# EasyEDA Pro project ProPrj_WashMach_F030F4P6_2026-03-06.epro

# Schematic Schematic1
Assembly Variant: Basic; Board Name: Board1; Create Date: 2026-03-01; Page Name: P1; Project Name: WashMach_F030F4P6; Schematic Name: Schematic1; Update Date: 2026-03-01; BladeWidth: 10; Company: 嘉立创EDA; Page Size: A4; RegionStart: 1; ShowBorder: 1; TitleBlock: 1; TitleBlockPosition: 3; Version: V1.0; XRegionCount: 6; YRegionCount: 4
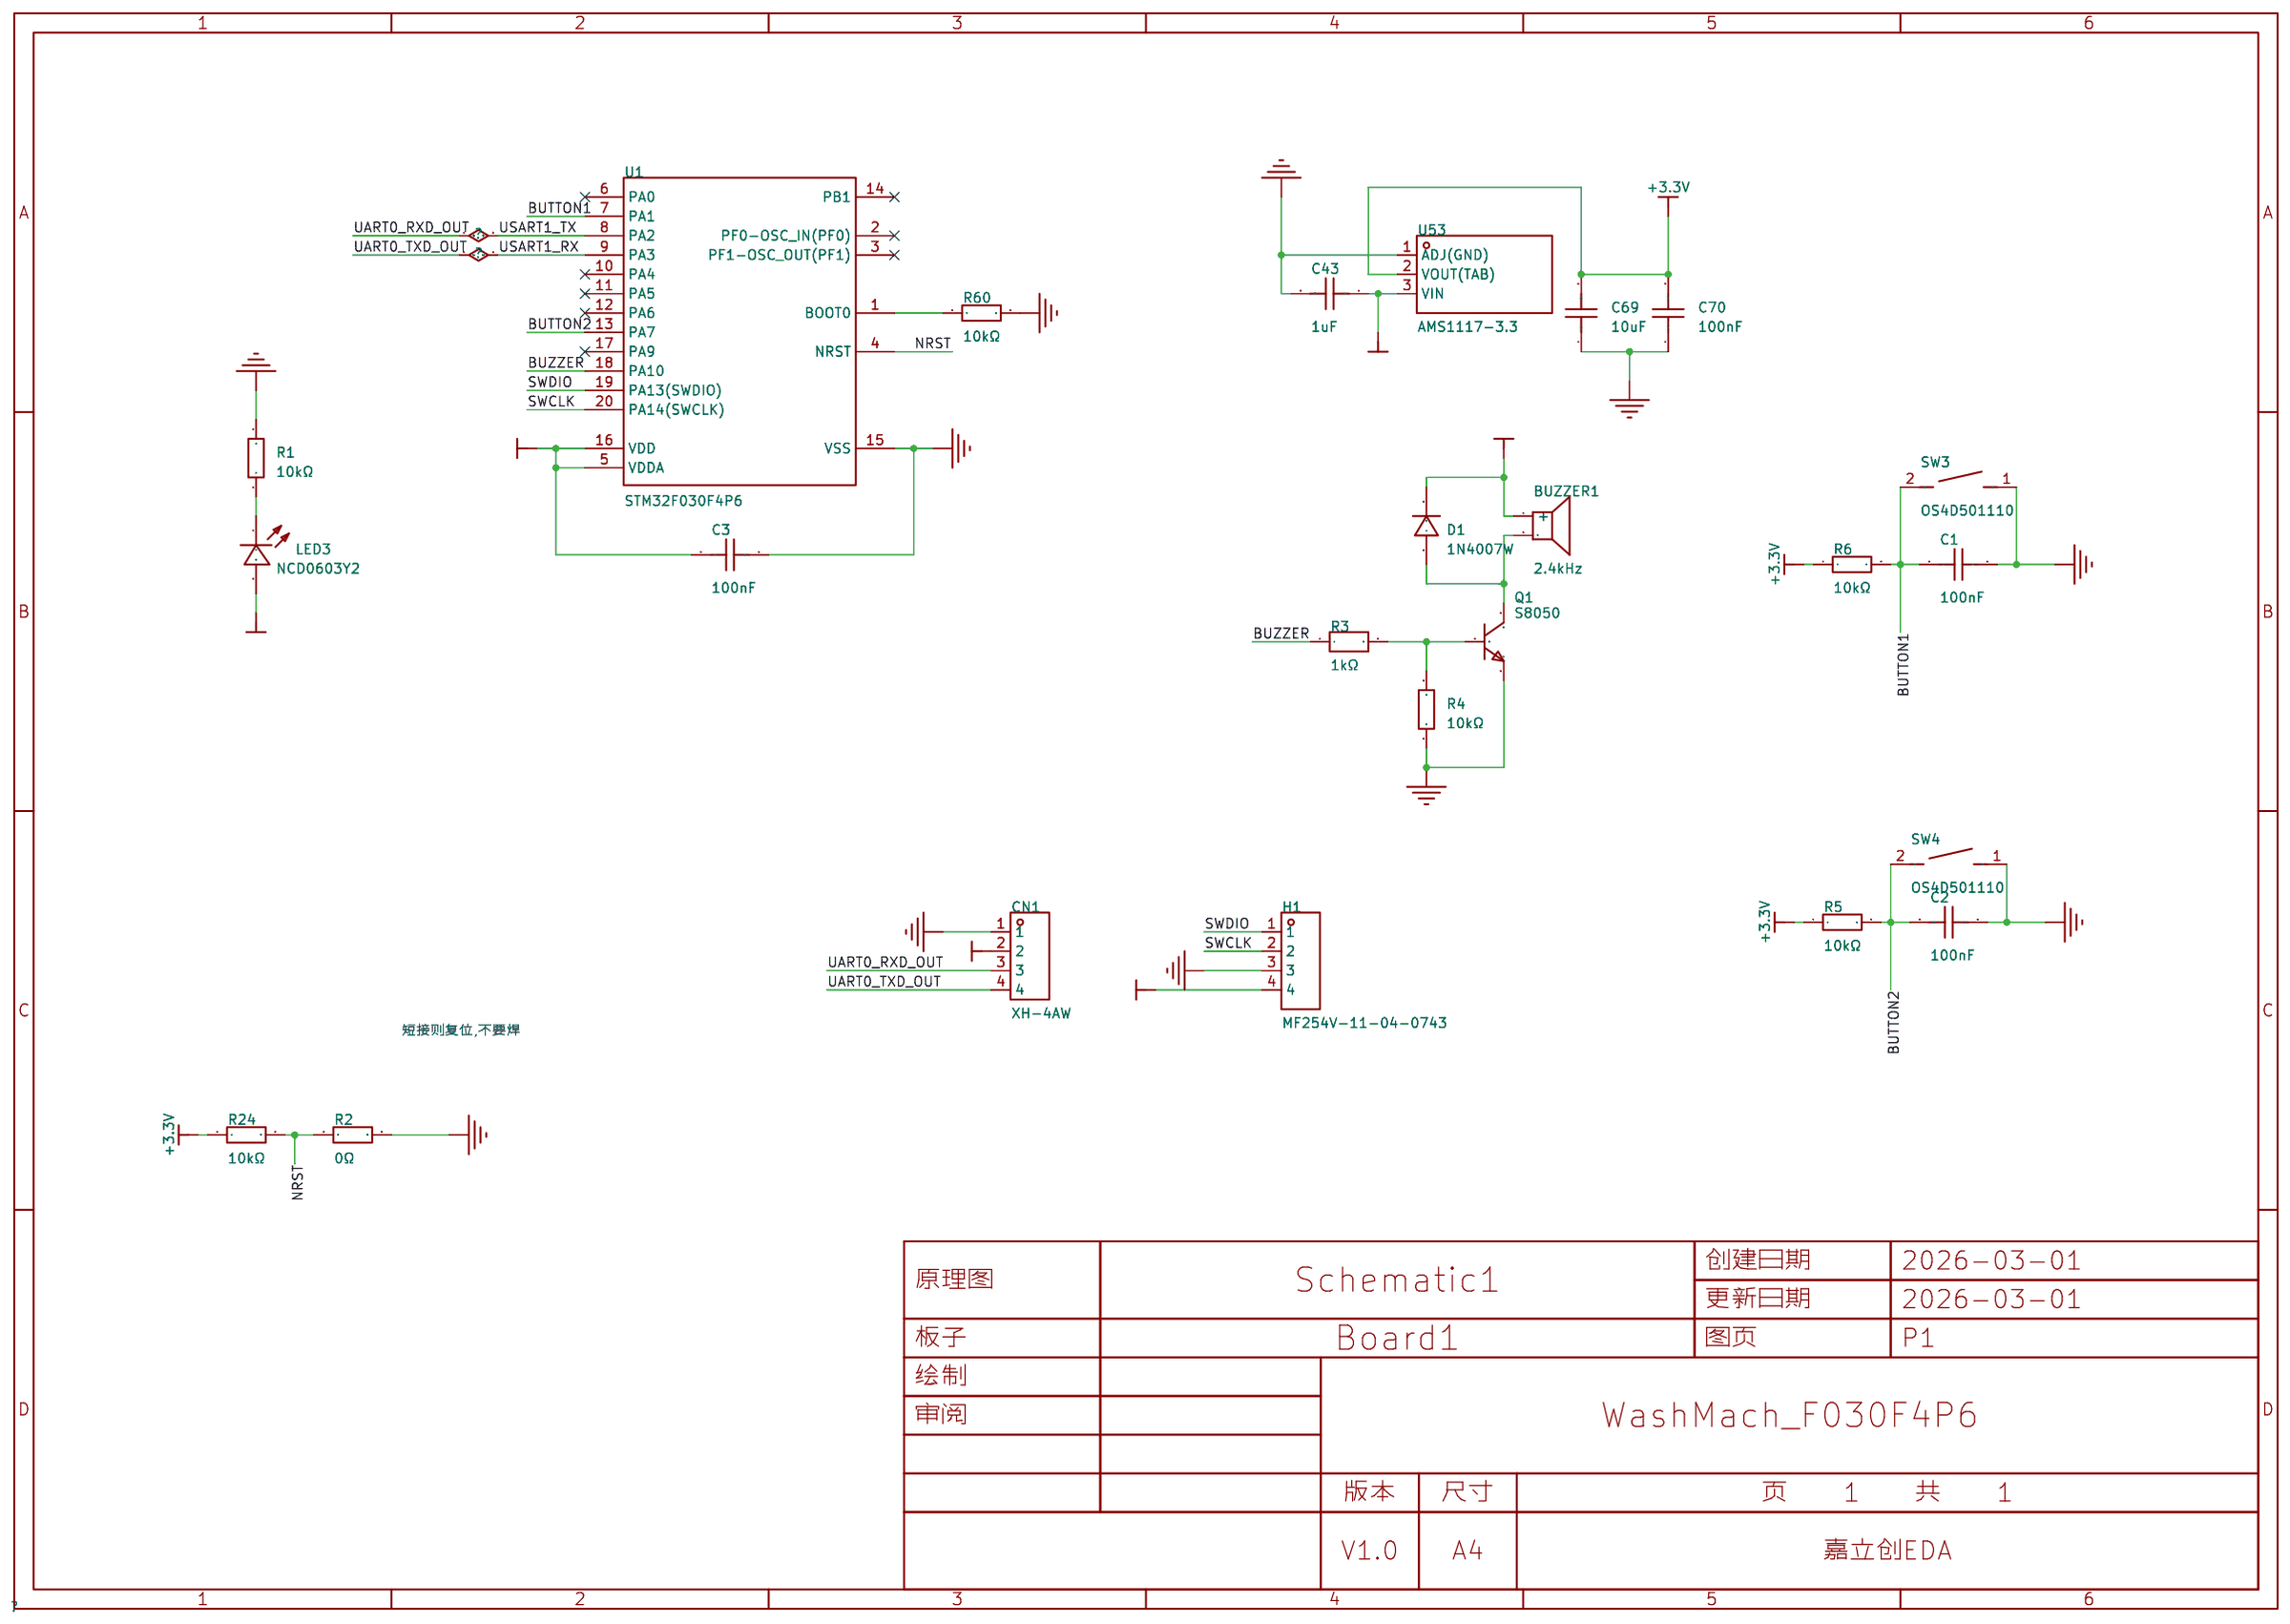
[diagram p0: schematic sheet]

## Parts
BUZZER1  2.4kHz  [BUZ-TH_BD12.0-P7.60-D0.6-FD]
C1  100nF  [C0603]
C2  100nF  [C0603]
C3  100nF  [C0603]
C43  1uF  [C0603]
C69  10uF  [C0603]
C70  100nF  [C0603]
CN1  XH-4AW  [CONN-TH_XH-4AW]
D1  1N4007W  [SOD-123FL_L2.7-W1.8-LS3.8-RD]
H1  MF254V-11-04-0743  [HDR-TH_4P-P2.54-V-F_MF254V-11-04-0743]
LED3  NCD0603Y2  [LED0603-RD]
Q1  S8050  [SOT-23-3_L2.9-W1.3-P1.90-LS2.3-BR]
R1  10kΩ  [R0603]
R2  0Ω  [R0603]
R3  1kΩ  [R0603]
R4  10kΩ  [R0603]
R5  10kΩ  [R0603]
R6  10kΩ  [R0603]
R24  10kΩ  [R0603]
R60  10kΩ  [R0603]
SW3  OS4D501110  [SW-SMD_L6.0-W6.0-P6.00-LS6.8]
SW4  OS4D501110  [SW-SMD_L6.0-W6.0-P6.00-LS6.8]
U1  STM32F030F4P6  [TSSOP-20_L6.5-W4.4-P0.65-LS6.4-BL]
U53  AMS1117-3.3  [SOT-89_L4.5-W2.5-P1.50-LS4.2-BR]

## Library data of the parts
BUZZER1 = TMB12A05_C96093: 驱动方式:有源(内含驱动线路);构造类型:电磁式;额定电压:5V;频率:2.4kHz;声压(SPL):85dB;; LCSC Part Name: 有源(内含驱动线路) 电磁式 2.4kHz; Supplier Part: C96093; Manufacturer: 华能; Manufacturer Part: TMB12A05; Supplier Footprint: 插件,D=12mm; JLCPCB Part Class: Extended Part; Datasheet: https://item.szlcsc.com/datasheet/TMB12A05/97297.html; Supplier: LCSC; Driver Circuitry: 有源(内含驱动线路); Technology: 电磁式; Voltage Rating: 5V; Voltage - Supply: 4V~8V; Current Consumption: 30mA; Sound Pressure Level(SPL): 85dB; Diameter(φD): 12mm; Height: 9.8mm; Operating Temperature: -40℃~+85℃
C1 C2 C70 = CC0603KRX7R9BB104: 容值:100nF;精度:±10%;额定电压:50V;材质(温度系数):X7R;; LCSC Part Name: 100nF ±10% 50V; Supplier Part: C14663; Manufacturer: YAGEO(国巨); Supplier Footprint: 0603; JLCPCB Part Class: 基础库; Datasheet: https://atta.szlcsc.com/upload/public/pdf/source/20180910/C282072_33301C7F631E79921B82A8DAC6BCC5B3.pdf; Supplier: LCSC; Tolerance: ±10%; Voltage Rated: 50V; Temperature Coefficient: X7R
C3 = CGA0603X7R104K500JT: 容值:100nF;精度:±10%;额定电压:50V;温度系数:X7R;; LCSC Part Name: 100nF ±10% 50V; Supplier Part: C6119867; Manufacturer: HRE(芯声); Supplier Footprint: 0603; JLCPCB Part Class: Extended Part; Datasheet: https://item.szlcsc.com/datasheet/CGA0603X7R104K500JT/7062573.html; Supplier: LCSC; Tolerance: ±10%; Voltage Rating: 50V; Temperature Coefficient: X7R
C43 = CL10A105KB8NNNC: 容值:1uF;精度:±10%;额定电压:50V;材质(温度系数):X5R;; LCSC Part Name: 1uF ±10% 50V; Supplier Part: C15849; Manufacturer: SAMSUNG(三星); Supplier Footprint: 0603; JLCPCB Part Class: 基础库; Datasheet: https://atta.szlcsc.com/upload/public/pdf/source/20160218/1457707763339.pdf; Supplier: LCSC; Tolerance: ±10%; Voltage Rated: 50V; Temperature Coefficient: X5R
C69 = CGA0603X5R106K100JT: 容值:10uF;精度:±10%;额定电压:10V;材质(温度系数):X5R;; LCSC Part Name: 10uF ±10% 10V; Supplier Part: C6119842; Manufacturer: HRE(芯声); Supplier Footprint: 0603; JLCPCB Part Class: 扩展库; Datasheet: https://item.szlcsc.com/datasheet/CGA0603X5R106K100JT/7062548.html; Supplier: LCSC; Tolerance: ±10%; Voltage Rating: 10V; Temperature Coefficient: X5R; Voltage Rated: 10V
CN1 = XH-4AW: 插针结构:1x4P;间距:2.54mm;安装方式:弯插;参考系列:XH;总PIN数:4P;排数:1;每排PIN数:4;行距:-;额定电流:3A;触头材质:黄铜;触头镀层:锡;工作温度:-25℃~+85℃;; LCSC Part Name: 1x4P 间距:2.54mm 弯插 系列:XH; Supplier Part: C2908613; Manufacturer: HCTL(华灿天禄); Supplier Footprint: 弯插,P=2.5mm; JLCPCB Part Class: Extended Part; Datasheet: https://item.szlcsc.com/datasheet/XH-4AW/3184384.html; Supplier: LCSC; Pins Structure: 1x4P; Pitch: 2.54mm; Mounting Type: 弯插; Reference Series: XH; Number of Pins: 4P; Number of Rows: 1; Number of PINs Per Row: 4; Current Rating: 3A; Contact Material: 黄铜; Contact Plating: 锡; Operating Temperature: -25℃~+85℃; Voltage Rating: 250V; Plastic Material: PA66; Flame Retardant Rating: UL94V-0; Z-Height of the Board: 5.9mm; Y-Width of Bottom Edge on Board: 7mm
D1 = 1N4007W_C18199088: 二极管配置:独立式;正向压降(Vf):1V@1.0A;直流反向耐压(Vr):1kV;整流电流:1A;; LCSC Part Name: 1kV 1A; Supplier Part: C18199088; Manufacturer: R+O(宏嘉诚); Supplier Footprint: SOD-123FL; JLCPCB Part Class: Extended Part; Datasheet: https://item.szlcsc.com/datasheet/1N4007W/19354320.html; Supplier: LCSC; Diode Configuration: 独立式; Voltage - Forward(Vf@If): 1V@1.0A; Voltage - DC Reverse(Vr): 1kV; Current - Rectified: 1A; Reverse Leakage Current (Ir): 2uA@1000V; Non-Repetitive Peak Forward Surge Current: 30A; Operating Junction Temperature Range: -55℃~+150℃
H1 = MF254V-11-04-0743: 插孔结构:1x4P;间距:2.54mm;行距:-;圆孔/方孔:圆孔;安装方式:直插;排数:单排;总孔位数:4P;额定电流:3A;额定电压:-;插孔方向:顶部;塑高:3mm;工作温度:-40℃~+105℃;; LCSC Part Name: 间距:2.54mm 1x4P 直插; Supplier Part: C2889986; Manufacturer: XFCN(兴飞); Supplier Footprint: 插件,P=2.54mm; JLCPCB Part Class: Extended Part; Datasheet: https://item.szlcsc.com/datasheet/MF254V-11-04-0743/3112799.html; Supplier: LCSC; Holes Structure: 1x4P; Pitch: 2.54mm; Circular Hole / Square Hole: 圆孔; Mounting Type: 直插; Number of Rows: 单排; Number of Positions: 4P; Current Rating: 3A; Holes Direction: 顶部; Insulation Height: 3mm; Operating Temperature: -40℃~+105℃
LED3 = NCD0603Y2: 发光颜色:黄色;正向电压(VF):1.6V~2.6V;功率:65mW;正向电流:20mA;主波长:586nm~595nm;透镜颜色:无色透明透镜;发光强度:100mcd~220mcd;发光角度:130°;工作温度:-30℃~+85℃;; Supplier Part: C89811; Manufacturer: 国星光电; Supplier Footprint: 0603; JLCPCB Part Class: 扩展库; Datasheet: https://atta.szlcsc.com/upload/public/pdf/source/20200820/C89811_7FE84B429B6BCA3E113B125EE1452576.pdf; Supplier: LCSC; Emitted Color: 黄色; Forward Voltage (VF): 1.6V~2.6V; Power Dissipation: 65mW; Forward Current: 20mA; Dominant Wavelength: 586nm~595nm; Lens Color: 无色透明透镜; Luminous Intensity: 100mcd~220mcd; Viewing Angle: 130°; Operating Temperature: -30℃~+85℃
Q1 = S8050_C20069125: 晶体管类型:NPN;集电极电流(Ic):500mA;集射极击穿电压(Vceo):25V;耗散功率(Pd):300mW;直流电流增益(hFE):120@50mA,1.0V;; LCSC Part Name: hFE:200-350，丝印:J3Y NPN 500mA 25V; Supplier Part: C20069125; Manufacturer: R+O(宏嘉诚); Supplier Footprint: SOT-23; JLCPCB Part Class: Extended Part; Datasheet: https://item.szlcsc.com/datasheet/S8050/21397163.html; Supplier: LCSC; type: NPN; Current - Collector(Ic): 500mA; Collector - Emitter Voltage VCEO: 25V; Pd - Power Dissipation: 300mW; DC Current Gain: 120@50mA,1.0V; Transition frequency(fT): 100MHz; Current - Collector Cutoff: 100nA; Vce Saturation(VCE(sat)): 600mV@500mA,50mA; Operating Temperature: -55℃~+150℃; Emitter-Base Voltage(Vebo): 5V
R1 R5 R6 R24 R60 = 0603WAF1002T5E: 电阻类型:厚膜电阻;阻值:10kΩ;精度:±1%;功率:100mW;最大工作电压:75V;温度系数:±100ppm/℃;; LCSC Part Name: 厚膜电阻 10kΩ ±1% 100mW; Supplier Part: C25804; Manufacturer: UNI-ROYAL(厚声); Supplier Footprint: 0603; JLCPCB Part Class: Basic Part; Datasheet: https://atta.szlcsc.com/upload/public/pdf/source/20200306/C422600_1E6D84923E4A46A82E41ADD87F860B5C.pdf; Supplier: LCSC; Type: 厚膜电阻; Tolerance: ±1%; Power(Watts): 100mW; Voltage-Supply(Max): 75V; Temperature Coefficient: ±100ppm/℃; Operating Temperature: -55℃~+155℃; Overload Voltage (Max): 75V; Operating Temperature Range: -55℃~+155℃
R2 = RC0603FR-070RL: 电阻类型:厚膜电阻;阻值:0Ω;精度:±1%;功率:100mW;工作电压:75V;温度系数:-;; LCSC Part Name: 厚膜电阻 0Ω ±1% 100mW; Supplier Part: C100044; Manufacturer: YAGEO(国巨); Supplier Footprint: 0603; JLCPCB Part Class: Extended Part; Datasheet: https://item.szlcsc.com/datasheet/RC0603FR-070RL/101258.html; Supplier: LCSC; Type: 厚膜电阻; Tolerance: ±1%; Power(Watts): 100mW; Voltage-Supply(Max): 75V; Operating Temperature: -55℃~+155℃
R3 = FRC0603F1001TS: 电阻类型:厚膜电阻;阻值:1kΩ;精度:±1%;功率:100mW;工作电压:75V;温度系数:±100ppm/℃;; LCSC Part Name: 1kΩ ±1% 100mW 厚膜电阻; Supplier Part: C2907002; Manufacturer: FOJAN(富捷); Supplier Footprint: 0603; JLCPCB Part Class: Extended Part; Supplier: LCSC; Type: 厚膜电阻; Tolerance: ±1%; Power(Watts): 100mW; Voltage-Supply(Max): 75V; Temperature Coefficient: ±100ppm/℃; Operating Temperature: -55℃~+155℃
R4 = 0603WAF1002T5E: 电阻类型:厚膜电阻;阻值:10kΩ;精度:±1%;功率:100mW;工作电压:75V;温度系数:±100ppm/℃;; LCSC Part Name: 厚膜电阻 10kΩ ±1% 100mW; Supplier Part: C25804; Manufacturer: UNI-ROYAL(厚声); Supplier Footprint: 0603; JLCPCB Part Class: Basic Part; Datasheet: https://item.szlcsc.com/datasheet/0603WAF1002T5E/26547.html; Supplier: LCSC; Type: 厚膜电阻; Tolerance: ±1%; Power(Watts): 100mW; Voltage-Supply(Max): 75V; Temperature Coefficient: ±100ppm/℃; Operating Temperature: -55℃~+155℃
SW3 SW4 = OS4D501110: 电路结构:单刀单掷;按钮形状:圆形按钮;作用力:1.8N;安装方式:-;开关长度:6mm;开关宽度:6mm;开关高度:5mm;触点电流:50mA;额定电压:12V;带灯:无;工作寿命:10万次;; LCSC Part Name: 轻触开关6*6*5 翘两脚贴片硅胶柄无声开关 180gf; Supplier Part: C42402920; Manufacturer: SAMZO(三佐); Supplier Footprint: SMD,6x6mm; JLCPCB Part Class: Extended Part; Datasheet: https://item.szlcsc.com/datasheet/OS4D501110/44364783.html; Supplier: LCSC; Circuit: 单刀单掷; Actuator Style: 圆形按钮; Operating Force: 1.8N; Length: 6mm; Width: 6mm; Switch Height: 5mm; Contact Current: 50mA; Voltage Rating: 12V; Actuator/Cap Color: 黑色; With Lamp: 无; Life: 10万次; Operating Temperature: -25℃~+85℃
U1 = STM32F030F4P6: CPU内核:ARM-M0;CPU最大主频:48MHz;应用领域:-;; LCSC Part Name: 主流ARM Cortex-M0超值系列MCU，具有16 KB Flash和48 MHz CPU; Supplier Part: C32908; Manufacturer: ST(意法半导体); Supplier Footprint: TSSOP-20; JLCPCB Part Class: Extended Part; Datasheet: https://item.szlcsc.com/datasheet/STM32F030F4P6/33873.html; Supplier: LCSC; CPU Core: ARM-M0; CPU Maximum Speed: 48MHz; Program Storage Size: 16KB; Program Memory Type: FLASH; Number of I/O: 15; ADC (Bit): 12bit; Voltage - Supply: 2.4V~3.6V
U53 = AMS1117-3.3_C347256: 输出类型:固定;工作电压:18V;输出电压:3.3V;输出电流:1A;电源纹波抑制比(PSRR):60dB@(120Hz);输出极性:正极;; LCSC Part Name: 输出:3.3V 电流:1A 耐压:18V; Supplier Part: C347256; Manufacturer: UMW(友台半导体); Supplier Footprint: SOT-89; JLCPCB Part Class: 扩展库; Datasheet: https://atta.szlcsc.com/upload/public/pdf/source/20241218/BAF0263FA2E44BCD8AF41AA4FA04EFAA.pdf; Supplier: LCSC; Output Type: 固定; Voltage - Supply: 18V; Output Voltage: 3.3V; Output Current: 1A; Power Supply Rejection Ratio (PSRR): 60dB@(120Hz); Voltage Dropout: 1.3V@(1A); Features: 过流保护(OCP); Output Configuration: 正极; Number of Outputs: 1

## Nets
+3.3V: C3.1 C69.2 C70.2 H1.4 LED3.2(A) R5.1 R6.1 R24.1 U1.5(VDDA) U1.16(VDD) U53.2(VOUT(TAB))
+5V: BUZZER1.1(+) C43.1 CN1.2 D1.1(K) U53.3(VIN)
GND: C1.2 C2.2 C3.2 C43.2 C69.1 C70.1 CN1.1 H1.3 Q1.2(E) R1.1 R2.2 R4.1 R60.1 SW3.1 SW4.1 U1.15(VSS) U53.1(ADJ(GND))
BUTTON1: C1.1 R6.2 SW3.2 U1.7(PA1)
BUTTON2: C2.1 R5.2 SW4.2 U1.13(PA7)
BUZZER: R3.1 U1.18(PA10)
NRST: R2.1 R24.2 U1.4(NRST)
SWCLK: H1.2 U1.20(PA14(SWCLK))
SWDIO: H1.1 U1.19(PA13(SWDIO))
UART0_RXD_OUT: CN1.3 U1.8(PA2)
UART0_TXD_OUT: CN1.4 U1.9(PA3)
$1N6: Q1.1(B) R3.2 R4.2
$1N8: BUZZER1.2 D1.2(A) Q1.3(C)
$1N51: R60.2 U1.1(BOOT0)
$1N66: LED3.1(K) R1.2

Not connected (* = marked no-connect by the designer): U1 2(PF0-OSC_IN(PF0))* 3(PF1-OSC_OUT(PF1))* 6(PA0)* 10(PA4)* 11(PA5)* 12(PA6)* 14(PB1)* 17(PA9)*

## Notes on the sheet
- 短接则复位,不要焊

# Board PCB1
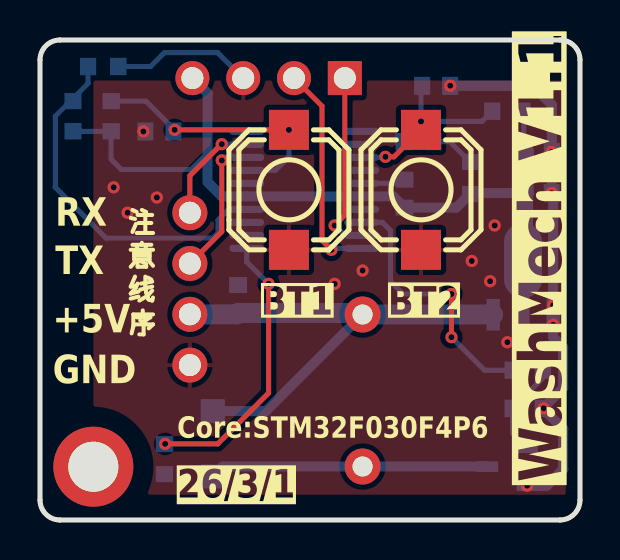
[diagram p1: board, top side]
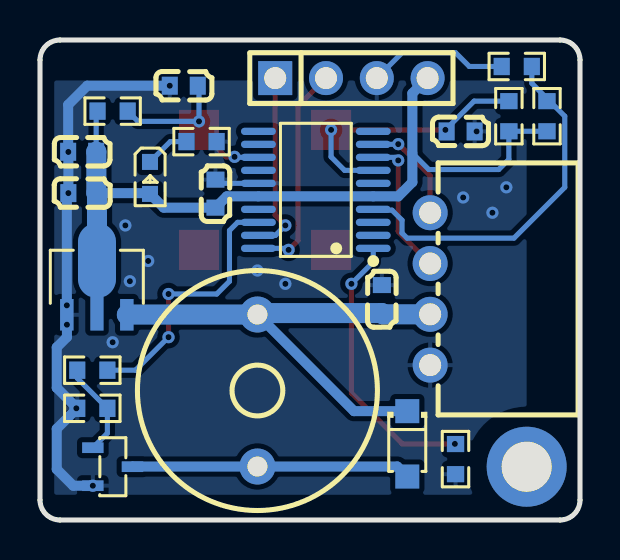
[diagram p2: board, bottom side, seen from below]

Outline 27 x 24 mm; copper layers: Top Layer, Bottom Layer. Coordinates in mm from the lower left corner of the outline.
Outline path: 0,23 0,1 arc(0.29,0.29) 1,0 26,0 arc(26.71,0.29) 27,1 27,23 arc(26.71,23.71) 26,24 1,24 arc(0.29,23.71) 0,23
Stack: Top Layer 0.035mm / Dielectric1 1.51mm FR4 er 4.5 / Bottom Layer 0.035mm

## Design rules (mm)
spacing copperThickness1oz (default): track to track 0.102, other pairs 0.152 to 0.3
spacing copperThickness2oz: track to track 0.203, other pairs 0.152 to 0.3
track width copperThickness1oz (default): min 0.127, default 0.254, max 2.54
track width copperThickness2oz: min 0.203, default 0.254, max 2.54
differential pair differentialPair (default): width min 0.127, default 0.254, max 2.54; gap min 0.152, default 0.152
net GND uses copperRegion

## Placement (name value [footprint] x y rotation side)
BUZZER1  2.4kHz  [BUZ-TH_BD12.0-P7.60-D0.6-FD]  16.13 6.47 270 bottom
C1  100nF  [C0603]  5.97 19.43 180 bottom
C2  100nF  [C0603]  19.81 21.71 0 bottom
C3  100nF  [C0603]  18.23 16.32 90 bottom
C43  1uF  [C0603]  9.91 11.05 90 bottom
C69  10uF  [C0603]  24.89 18.41 180 bottom
C70  100nF  [C0603]  24.88 16.34 180 bottom
CN1  XH-4AW  [CONN-TH_XH-4AW]  7.49 11.55 90 bottom
D1  1N4007W  [SOD-123FL_L2.7-W1.8-LS3.8-RD]  8.64 3.81 270 bottom
H1  MF254V-11-04-0743  [HDR-TH_4P-P2.54-V-F_MF254V-11-04-0743]  11.43 22.09 180 bottom
LED3  NCD0603Y2  [LED0603-RD]  21.5 17.1 270 bottom
NOREF  -  [Pad_e208]  2.67 2.66 0 top
Q1  S8050  [SOT-23-3_L2.9-W1.3-P1.90-LS2.3-BR]  23.37 2.66 0 bottom
R1  10kΩ  [R0603]  18.92 18.92 0 bottom
R2  0Ω  [R0603]  3.16 22.68 0 bottom
R3  1kΩ  [R0603]  24.38 7.49 0 bottom
R4  10kΩ  [R0603]  24.38 5.58 180 bottom
R5  10kΩ  [R0603]  23.37 20.44 180 bottom
R6  10kΩ  [R0603]  3.56 20.19 90 bottom
R24  10kΩ  [R0603]  1.65 20.19 90 bottom
R60  10kΩ  [R0603]  6.22 3.05 90 bottom
SW3  OS4D501110  [SW-SMD_L6.0-W6.0-P6.00-LS6.8]  12.45 16.51 90 top
SW4  OS4D501110  [SW-SMD_L6.0-W6.0-P6.00-LS6.8]  19.05 16.51 90 top
U1  STM32F030F4P6  [TSSOP-20_L6.5-W4.4-P0.65-LS6.4-BL]  13.21 16.51 90 bottom
U53  AMS1117-3.3  [SOT-89_L4.5-W2.5-P1.50-LS4.2-BR]  24.16 11.62 270 bottom

## Footprints (pads in the part's own frame, mm; a bottom-side part is the same pattern mirrored in y, then rotated)
BUZ-TH_BD12.0-P7.60-D0.6-FD
  round 1.8 hole 1: 1(-3.8,0) 2(3.8,0)
C0603
  rect 0.8x0.9 smd: 1(-0.7,0) 2(0.7,0)
CONN-TH_XH-4AW
  round 1.75 hole 1.1: 1(-3.81,0) 2(-1.27,0) 3(1.27,0) 4(3.81,0)
HDR-TH_4P-P2.54-V-F_MF254V-11-04-0743
  rect 1.7x1.7 hole 1.1: 1(-3.81,0)
  round 1.7 hole 1.1: 2(-1.27,0) 3(1.27,0) 4(3.81,0)
LED0603-RD
  rect 0.8x0.8 smd: 1(-0.799,0) 2(0.799,0)
Pad_e208
  round 4 hole 2.5: 1(0,0)
R0603
  rect 0.806x0.864 smd: 1(-0.753,0) 2(0.753,0)
SOD-123FL_L2.7-W1.8-LS3.8-RD
  rect 1.2x1.2 smd: 1(-1.635,0) 2(1.635,0)
SOT-23-3_L2.9-W1.3-P1.90-LS2.3-BR
  rect 1.07x0.532 smd: 1(0.99,-0.95) 2(0.99,0.95) 3(-0.99,0)
SOT-89_L4.5-W2.5-P1.50-LS4.2-BR
  rect 1.575x0.672 smd: 1(1.356,-1.5) 3(1.356,1.5)
  custom 5.377x1.9 smd: 2(-1.356,0.009)
SW-SMD_L6.0-W6.0-P6.00-LS6.8
  rect 2x2 smd: 1(-3,0) 2(3,0)
TSSOP-20_L6.5-W4.4-P0.65-LS6.4-BL
  oval 0.364x1.742 smd: 1(-2.925,-2.871) 2(-2.275,-2.871) 3(-1.625,-2.871) 4(-0.975,-2.871) 5(-0.325,-2.871) 6(0.325,-2.871) 7(0.975,-2.871) 8(1.625,-2.871) 9(2.275,-2.871) 10(2.925,-2.871) 11(2.925,2.871) 12(2.275,2.871) 13(1.625,2.871) 14(0.975,2.871) 15(0.325,2.871) 16(-0.325,2.871) 17(-0.975,2.871) 18(-1.625,2.871) 19(-2.275,2.871) 20(-2.925,2.871)

## Nets
As in the schematic.

Pads without a net: NOREF 1; U1 2 3 6 10 11 12 14 17

## Via types
v1: diameter 0.61, hole 0.305, Top Layer to Bottom Layer, 29 vias

## Routing (per net, layer and track width the routed paths; a pad name or vN(x,y) marks a point on that pad's centre or on a via; arc(x,y) is an arc through that point)
+3.3V: length 38.4
  Bottom Layer w0.254: 8.38,18.35 7.56,17.52 4.06,17.52 3.56,18.03 R6.1 R24.1 ; C69.2 24.19,20.37 R5.1
  Bottom Layer w0.5: H1.4 8.38,21.33 8.38,16.89 9.09,16.18 U1.5 U1.16 17.66,16.18 C3.1 20.81,15.62 21.5,16.31 21.54,16.34 C70.2
  Bottom Layer w1: U53.2 24.15,16.31 C70.2 24.18,18.4 C69.2
+5V: length 24.7
  Bottom Layer w0.5: D1.1 11.3,5.44 BUZZER1.1
  Bottom Layer w1: U53.3 22.65,10.27 BUZZER1.1 16.06,10.35 C43.1 9.84,10.28 CN1.2
GND: length 36.2
  Bottom Layer w0.254: H1.3 8.89,23.36 6.22,23.36 5.53,22.68 R2.2 ; C3.2 18.04,16.83 U1.15
  Bottom Layer w0.5: v1(24.36,1.71) 25.34,1.71 26.16,2.54 26.16,4.56 R4.1 26.16,6.61 26.16,8.63 25.65,9.14 v1(25.65,9.76) 25.65,10.26 U53.1 v1(25.66,10.73) 25.66,16.27 v1(25.58,16.34) v1(25.58,18.4) C69.1 25.59,20.76 24.64,21.71 v1(20.51,21.71)
  vias: v1(3.68,16.63) v1(4.38,15.36) v1(5.17,19.43) v1(5.84,16.13) v1(14.73,11.81) v1(16.13,12.47) v1(21.59,12.95) v1(22.51,11.94) v1(22.73,14.73) v1(23.37,8.89) v1(25.18,5.58)
BUTTON1: length 13.2
  Top Layer w0.254: v1(12.45,19.51) v1(6.73,19.51)
  Bottom Layer w0.254: v1(12.45,19.51) 12.45,18.16 11.77,17.48 U1.7 ; R6.2 5.29,20.94 v1(6.73,19.51)
BUTTON2: length 9.1
  Top Layer w0.254: SW4.2 17.7,18.16 v1(17.27,18.16)
  Bottom Layer w0.254: U1.13 17.25,18.13 v1(17.27,18.16) ; C2.1 19.05,21.65 v1(19.05,19.93) 22.1,19.93 R5.2
BUZZER: length 13.4
  Top Layer w0.254: v1(20.57,11.3) v1(20.57,9.14)
  Bottom Layer w0.254: U1.18 17.12,14.88 17.53,14.47 17.53,11.94 18.16,11.3 v1(20.57,11.3) ; v1(20.57,9.14) 22.23,7.49 R3.1
NRST: length 18.3
  Bottom Layer w0.254: R2.1 2.41,21.84 0.76,20.19 0.76,16.63 3.3,14.09 8.65,14.09 8.9,14.35 8.9,14.99 9.4,15.49 10.3,15.49 U1.4
SWCLK: length 10.8
  Top Layer w0.254: H1.2 14.1,20.7 14.1,13.98 v1(14.57,13.51)
  Bottom Layer w0.254: U1.20 14.61,13.58
SWDIO: length 9.1
  Top Layer w0.254: v1(14.73,14.73) 15.24,15.24 H1.1
  Bottom Layer w0.254: U1.19 15.23,14.23 v1(14.73,14.73)
UART0_RXD_OUT: length 7.1
  Top Layer w0.254: v1(9.09,17.98) 9.09,14.42 CN1.3
  Bottom Layer w0.254: v1(9.09,17.98) 9.24,18.13 U1.8
UART0_TXD_OUT: length 5.4
  Top Layer w0.254: CN1.4 7.49,17.21 8.85,18.56 8.86,18.56 v1(9.09,18.79)
  Bottom Layer w0.254: U1.9 9.1,18.78 v1(9.09,18.79)
$1N6: length 4.8
  Bottom Layer w0.254: R3.2 25.14,7.09 R4.2 23.63,4.34 Q1.1
$1N8: length 14
  Bottom Layer w0.5: D1.2 9.14,2.67 BUZZER1.2 22.37,2.67 Q1.3
$1N51: length 13.9
  Top Layer w0.254: v1(6.26,3.81) 8.89,3.81 11.43,6.35 v1(11.43,11.81)
  Bottom Layer w0.254: U1.1 10.34,12.9 v1(11.43,11.81)
$1N66: length 2.2
  Bottom Layer w0.254: LED3.1 20.48,18.92 R1.2

## Copper pours and planes (outline as drawn; the poured copper is in the pictures)
GND on Top Layer: -0.89,25.4 28.45,25.4 28.45,-1.53 -0.89,-1.53
GND on Bottom Layer: -1.78,24.51 29.72,24.51 29.72,-1.78 -1.78,-1.78

## Text on the board
Top Silkscreen Layer: Core:STM32F030F4P6 | +5V | GND | RX | TX | 26/3/1 | BT1 | BT2 | WashMech V1.1 | 注 / 意 / 线 / 序
